# EAGLE design 1U_display_adaptor_v1 (EAGLE 9.6.2)
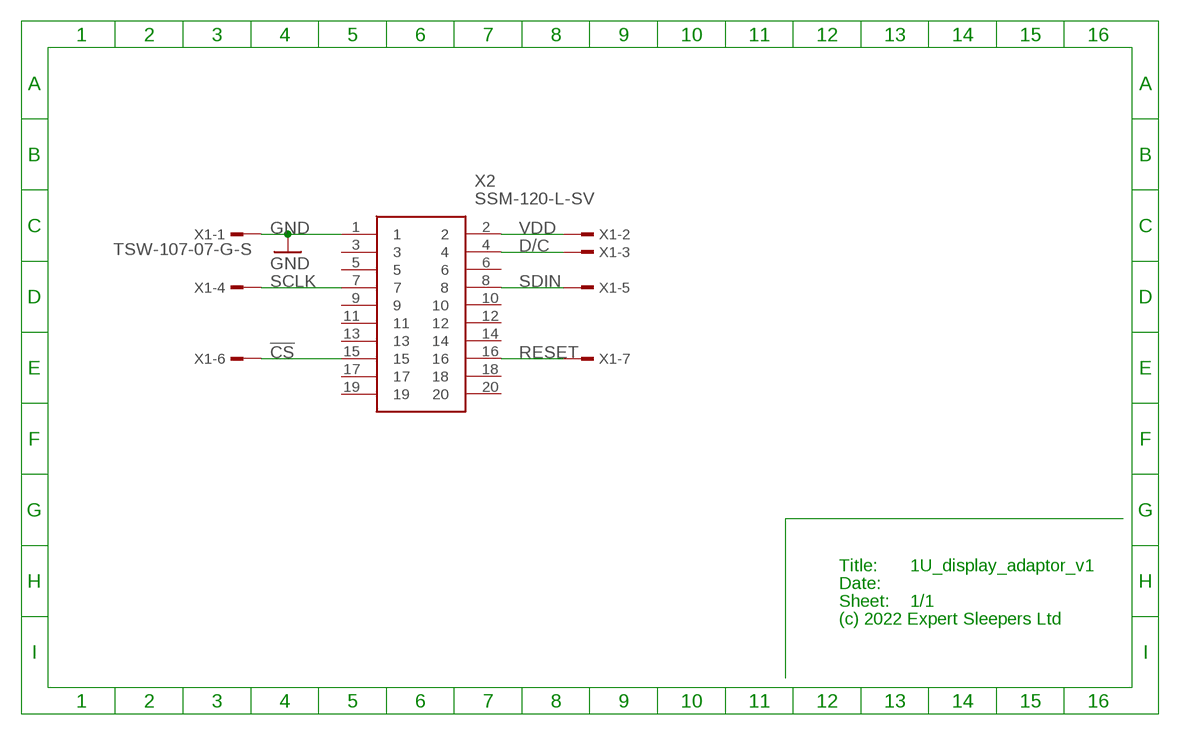
[diagram p0: schematic, sheet 1]

## Parts
X1  TSW-107-07-G-S  [TSW-107-XX-G-S]
X2  SSM-120-L-SV  [SSM120LSV]

## Nets
!CS: X1.6 X2.15
D/C: X1.3 X2.4
GND: X1.1 X2.1
RESET: X1.7 X2.16
SCLK: X1.4 X2.7
SDIN: X1.5 X2.8
VDD: X1.2 X2.2
Unconnected: X2.3 X2.5 X2.6 X2.9 X2.10 X2.11 X2.12 X2.13 X2.14 X2.17 X2.18 X2.19 X2.20

## Notes on the sheet
- Title:
- Date:
- Sheet:
- (c) 2022 Expert Sleepers Ltd

## Library data of the parts
X1 = con-samtec:TSW-107-*-G-S: THROUGH-HOLE .025" SQ POST HEADER Source: Samtec TSW.pdf; MF: Samtec Inc.; MPN: TSW-107-07-G-S
X2 = SamacSys_Parts:SSM-120-L-SV: Samtec SSM Series 2.54mm 20 Way 1 Row Straight PCB Socket Surface Mount Board to Board Source: Datasheet <http://suddendocs.samtec.com/prints/ssm-1xx-xxx-xx-xx-xx-x-xx-xx-mkt.pdf>; ARROW_PART_NUMBER: SSM-120-L-SV; ARROW_PRICE-STOCK: https://www.arrow.com/en/products/ssm-120-l-sv/samtec?region=nac; DESCRIPTION: Samtec SSM Series 2.54mm 20 Way 1 Row Straight PCB Socket Surface Mount Board to Board; HEIGHT: 7.37mm; MANUFACTURER_NAME: SAMTEC; MANUFACTURER_PART_NUMBER: SSM-120-L-SV; MOUSER_PART_NUMBER: 200-SSM120LSV; MOUSER_PRICE-STOCK: https://www.mouser.co.uk/ProductDetail/Samtec/SSM-120-L-SV?qs=rU5fayqh%252BE1nG%2F1BO%2F90Ng%3D%3D

## Board
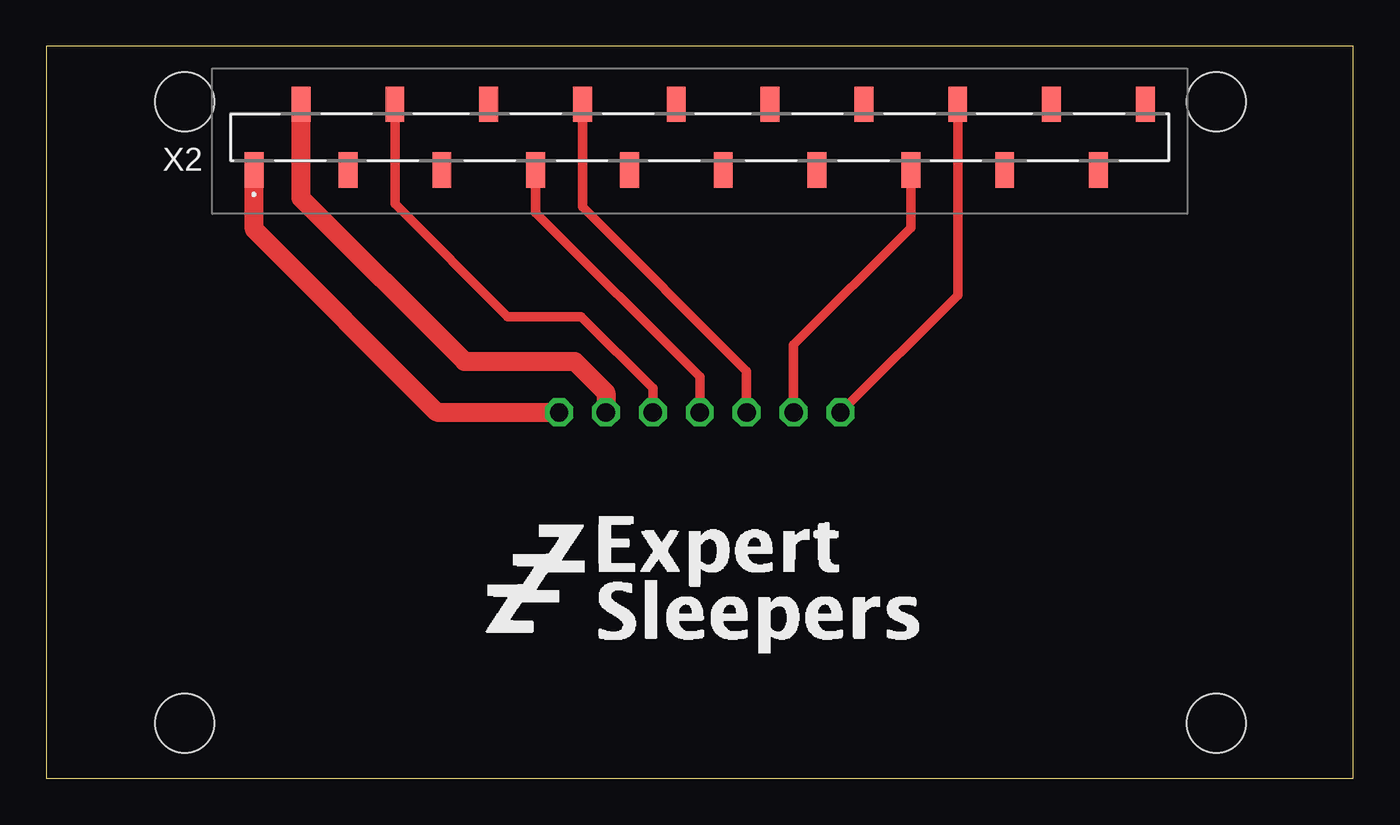
[diagram p1: board, top side]
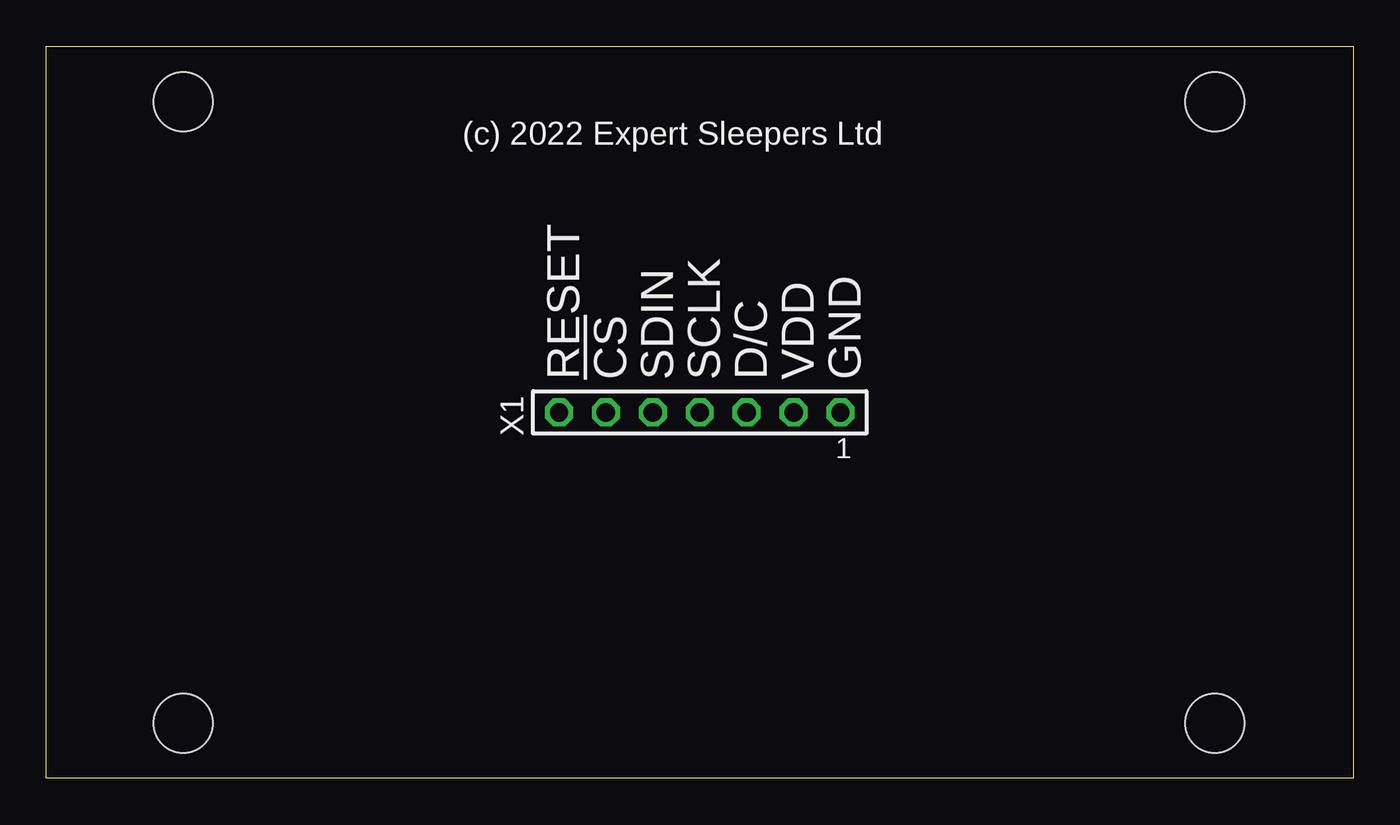
[diagram p2: board, bottom side, seen from below]

Size 70.8 x 39.65 mm. Coordinates in mm from the lower left corner, seen from the top.
Outline: 0,0 70.8,0 70.8,39.65 0,39.65 0,0
Copper layers (1*16): Top 0.035mm / dielectric 1.5mm / Bottom 0.035mm
Design rules "default": minimum track width 6mil, minimum drill 0.35mm, track to track 6mil, track to pad 6mil, pad to pad 6mil, via to via 6mil, smd to smd 6mil, copper to edge 40mil, drill to drill 6mil, minimum pad ring 10mil, minimum via ring 8mil, stop-mask expansion 4mil, vias tented up to drill 0mil, thermal gap 10mil
Holes 3.2 mm at 7.5,36.65 7.5,3 63.38,36.65 63.38,3

### Footprints (pad centres in the part's own frame; a part is rotated, then mirrored left to right if it is on the bottom)
TSW-107-XX-G-S = drill 1 pad 1.5 octagon: 1 7.62,0; 2 5.08,0; 3 2.54,0; 4 0,0; 5 -2.54,0; 6 -5.08,0; 7 -7.62,0
SSM120LSV = smd 1.02 x 1.905: 1 -24.13,-1.777; 2 -21.59,1.777; 3 -19.05,-1.777; 4 -16.51,1.777; 5 -13.97,-1.777; 6 -11.43,1.777; 7 -8.89,-1.777; 8 -6.35,1.777; 9 -3.81,-1.777; 10 -1.27,1.777; 11 1.27,-1.777; 12 3.81,1.777; 13 6.35,-1.777; 14 8.89,1.777; 15 11.43,-1.777; 16 13.97,1.777; 17 16.51,-1.777; 18 19.05,1.777; 19 21.59,-1.777; 20 24.13,1.777

### Placement (x,y rotation side)
U$1  [ES_ZZZ_TEXT_TPLACE_1IN_600DPI]  22.86,6.35 0 top
X1  35.4,19.82 0 bottom
X2  35.4,34.73 0 top

### Tracks (layer width: path | path; a pad name or v marks a point on that pad's centre or on a via)
!CS
  Top 0.508: X2.15 46.83,29.83 40.48,23.48 X1.6
D/C
  Top 0.508: X2.4 18.89,31.11 25,25 28.98,25 32.86,21.12 X1.3
GND
  Top 1.016: X2.1 11.27,29.73 21.16,19.84 27.78,19.84 X1.1
RESET
  Top 0.508: X1.7 49.37,26.18 X2.16
SCLK
  Top 0.508: X2.7 26.51,30.64 35.4,21.75 X1.4
SDIN
  Top 0.508: X2.8 29.05,30.95 37.94,22.06 X1.5
VDD
  Top 1.016: X2.2 13.81,31.43 22.65,22.59 28.63,22.59 30.32,20.89 X1.2

### Text on the board
bPlace: (c) 2022 Expert Sleepers Ltd | GND | VDD | D/C | SCLK | SDIN | !CS | RESET